# Altium schematic sheet 00_Main_Rev1.SchDoc: TiPi Projector
size A2; ApprovedBy: Prashant; DrawnBy: Prashant; Revision: 2; SheetNumber: 1; SheetTotal: 1
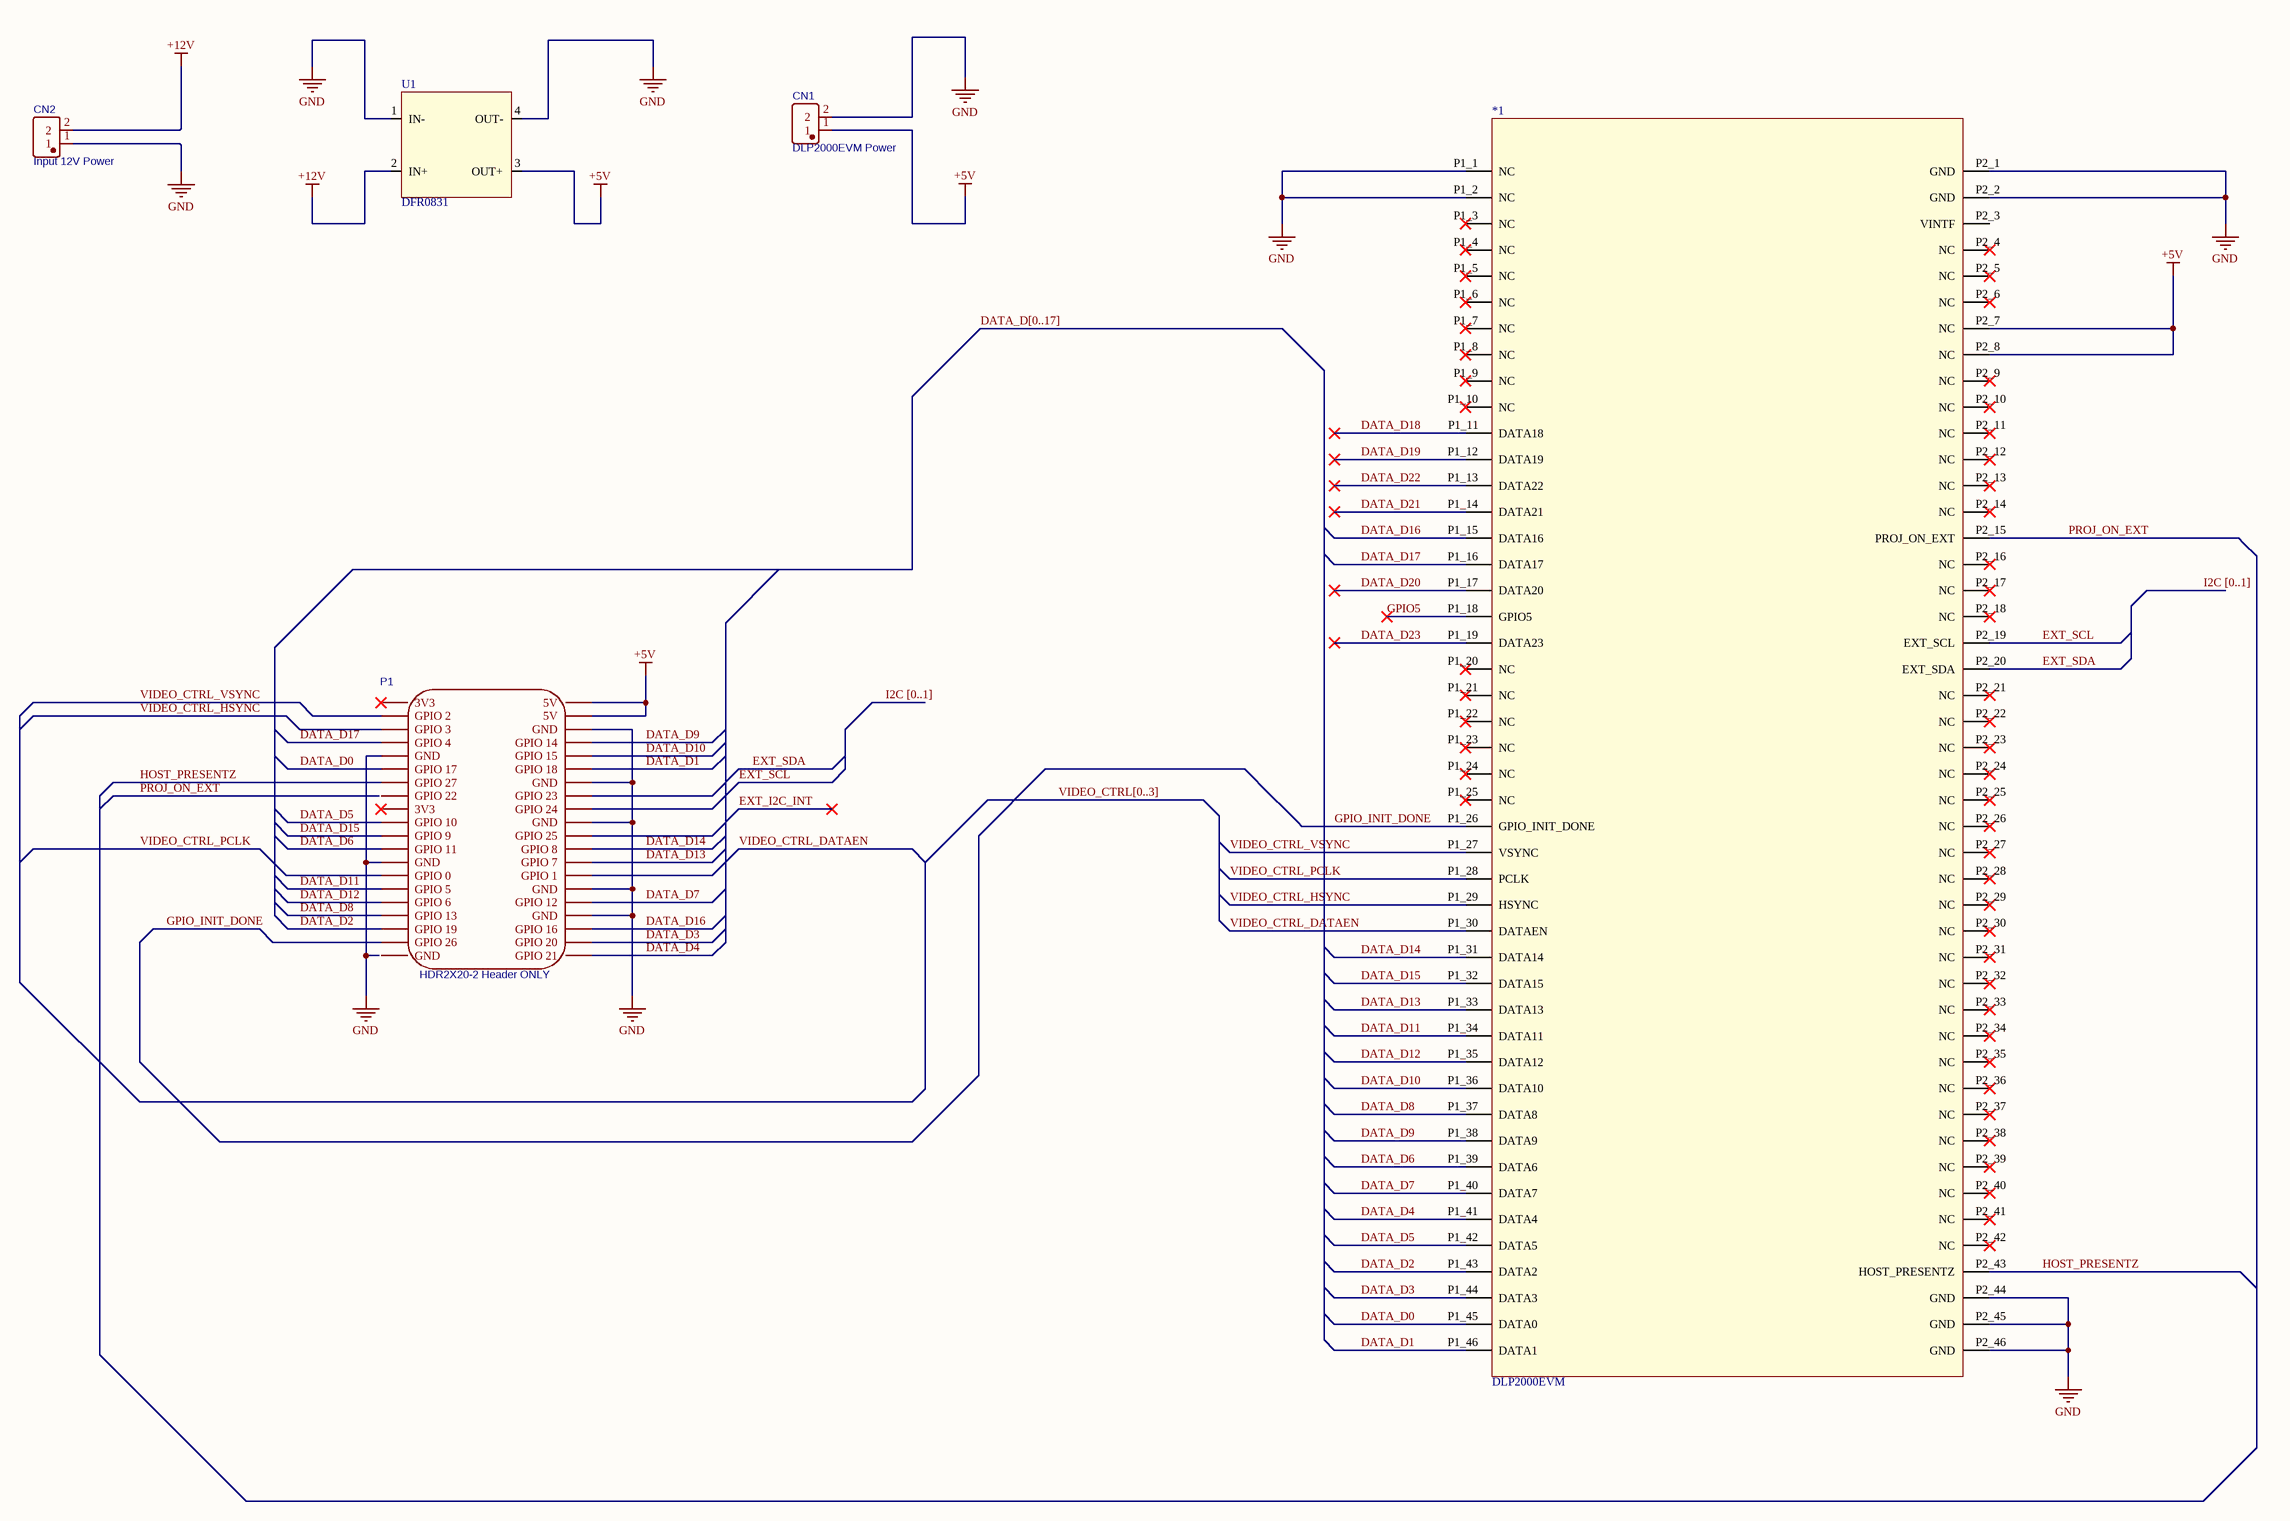
[diagram p0: 00_Main_Rev1.SchDoc]

## Parts
*1  DLP2000EVM  [DLP_2000EVM]
CN1  DLP2000EVM Power  [CONN-TH_2P-P2.54_JILN_JL141V-25402GA1]
CN2  Input 12V Power  [CONN-TH_2P-P2.54_JILN_JL141V-25402GA1]
P1  HDR2X20-2 Header ONLY  [Raspberry Pi A+]
U1  DFR0831  [DFR0831]

## Nets
+5V: *1.P2_7(NC) *1.P2_8(NC) CN1.1 P1.2(5V) P1.4(5V) U1.3(OUT+)
+12V: CN2.2 U1.2(IN+)
GND: *1.P1_1(NC) *1.P1_2(NC) *1.P2_1(GND) *1.P2_2(GND) *1.P2_44(GND) *1.P2_45(GND) *1.P2_46(GND) CN1.2 CN2.1 P1.6(GND) P1.9(GND) P1.14(GND) P1.20(GND) P1.25(GND) P1.30(GND) P1.34(GND) U1.1(IN-) U1.4(OUT-)
DATA_D0: *1.P1_45(DATA0) P1.11(GPIO_17)
DATA_D1: *1.P1_46(DATA1) P1.12(GPIO_18)
DATA_D2: *1.P1_43(DATA2) P1.35(GPIO_19)
DATA_D3: *1.P1_44(DATA3) P1.38(GPIO_20)
DATA_D4: *1.P1_41(DATA4) P1.40(GPIO_21)
DATA_D5: *1.P1_42(DATA5) P1.19(GPIO_10)
DATA_D6: *1.P1_39(DATA6) P1.23(GPIO_11)
DATA_D7: *1.P1_40(DATA7) P1.32(GPIO_12)
DATA_D8: *1.P1_37(DATA8) P1.33(GPIO_13)
DATA_D9: *1.P1_38(DATA9) P1.8(GPIO_14)
DATA_D10: *1.P1_36(DATA10) P1.10(GPIO_15)
DATA_D11: *1.P1_34(DATA11) P1.29(GPIO_5)
DATA_D12: *1.P1_35(DATA12) P1.31(GPIO_6)
DATA_D13: *1.P1_33(DATA13) P1.26(GPIO_7)
DATA_D14: *1.P1_31(DATA14) P1.24(GPIO_8)
DATA_D15: *1.P1_32(DATA15) P1.21(GPIO_9)
DATA_D16: *1.P1_15(DATA16) P1.36(GPIO_16)
DATA_D17: *1.P1_16(DATA17) P1.7(GPIO_4)
DATA_D18: *1.P1_11(DATA18)
DATA_D19: *1.P1_12(DATA19)
DATA_D20: *1.P1_17(DATA20)
DATA_D21: *1.P1_14(DATA21)
DATA_D22: *1.P1_13(DATA22)
DATA_D23: *1.P1_19(DATA23)
EXT_I2C_INT: P1.22(GPIO_25)
EXT_SCL: *1.P2_19(EXT_SCL) P1.18(GPIO_24)
EXT_SDA: *1.P2_20(EXT_SDA) P1.16(GPIO_23)
GPIO5: *1.P1_18(GPIO5)
GPIO_INIT_DONE: *1.P1_26(GPIO_INIT_DONE) P1.37(GPIO_26)
HOST_PRESENTZ: *1.P2_43(HOST_PRESENTZ) P1.13(GPIO_27)
PROJ_ON_EXT: *1.P2_15(PROJ_ON_EXT)
VIDEO_CTRL_DATAEN: *1.P1_30(DATAEN) P1.28(GPIO_1)
VIDEO_CTRL_HSYNC: *1.P1_29(HSYNC) P1.5(GPIO_3)
VIDEO_CTRL_PCLK: *1.P1_28(PCLK) P1.27(GPIO_0)
VIDEO_CTRL_VSYNC: *1.P1_27(VSYNC) P1.3(GPIO_2)

Not connected (* = marked no-connect by the designer): *1 P1_3(NC)* P1_4(NC)* P1_5(NC)* P1_6(NC)* P1_7(NC)* P1_8(NC)* P1_9(NC)* P1_10(NC)* P1_20(NC)* P1_21(NC)* P1_22(NC)* P1_23(NC)* P1_24(NC)* P1_25(NC)* P2_3(VINTF) P2_4(NC)* P2_5(NC)* P2_6(NC)* P2_9(NC)* P2_10(NC)* P2_11(NC)* P2_12(NC)* P2_13(NC)* P2_14(NC)* P2_16(NC)* P2_17(NC)* P2_18(NC)* P2_21(NC)* P2_22(NC)* P2_23(NC)* P2_24(NC)* P2_25(NC)* P2_26(NC)* P2_27(NC)* P2_28(NC)* P2_29(NC)* P2_30(NC)* P2_31(NC)* P2_32(NC)* P2_33(NC)* P2_34(NC)* P2_35(NC)* P2_36(NC)* P2_37(NC)* P2_38(NC)* P2_39(NC)* P2_40(NC)* P2_41(NC)* P2_42(NC)*; P1 1(3V3)* 15(GPIO_22) 17(3V3)* 39(GND)

## Buses and harness runs
bus DATA_D[0..17]
bus I2C [0..1]
bus VIDEO_CTRL[0..3]

## Notes on the sheet
- Title
- Size:
- Date:
- File:
- A2
- Number:
- Time:
- Revision:
- Sheet
- of

## Library data of the parts
CN1 CN2 = JL141V-25402GA1: BOM_Manufacturer: JILN(锦凌); Contributor: LCSC; BOM_Supplier: LCSC; BOM_Supplier Part: C2922619; BOM_Manufacturer Part: JL141V-25402GA1; BOM_JLCPCB Part Class: Extended Part; spicePre: C; spiceSymbolName: JL141V-25402GA1
P1 = Raspberry Pi A+: Header Only; sourceId: ajhDnJ4OM; timeStamp: 1467473853; spicePre: P; spiceSymbolName: HDR2X20-2
U1 = DFR0831: DC-DC Buck Converter 7-24V to 5V 4A